# EAGLE schematic TERMINAL_SHIELD_ESP32 (EAGLE 9.2.2)
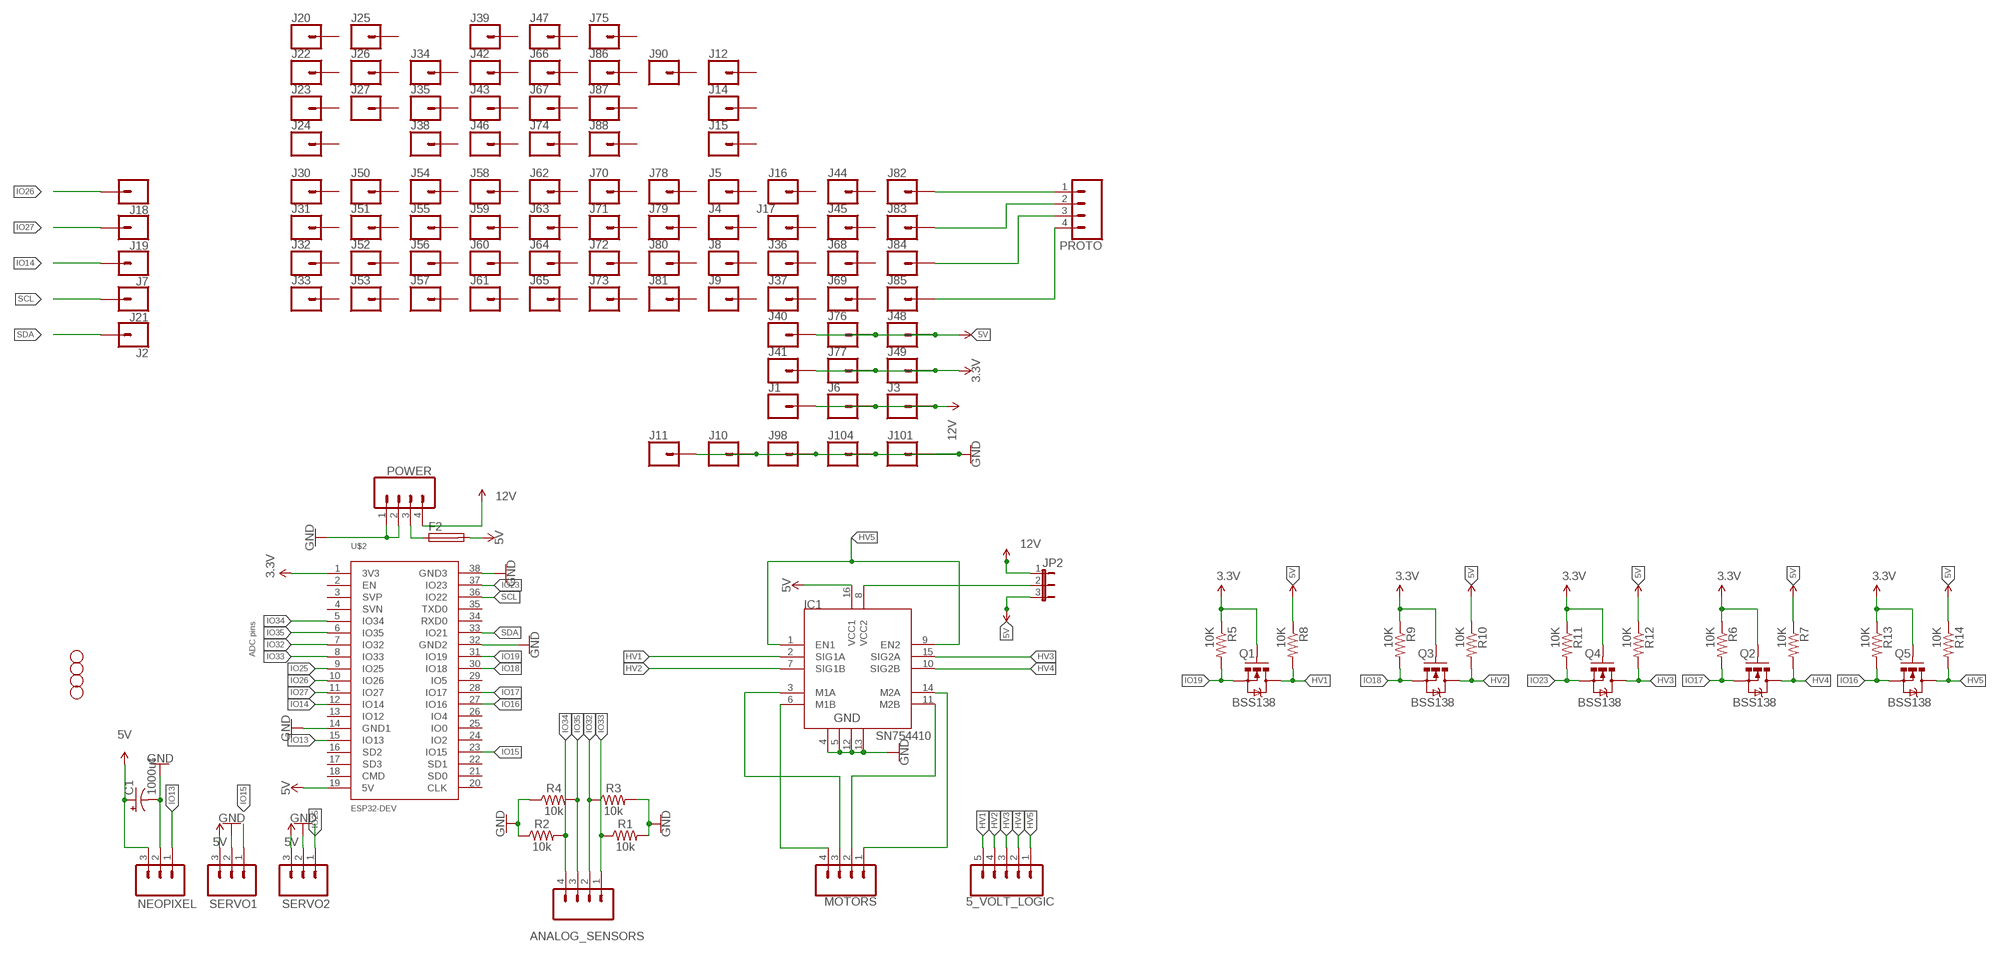
[diagram p0: schematic, sheet 1]

## Parts
5_VOLT_LOGIC  CONN_05SCREW  [SCREWTERMINAL-3.5MM-5]
ANALOG_SENSORS  CONN_04SCREW  [SCREWTERMINAL-3.5MM-4]
C1  1000uf  1000UF-RADIAL-5MM-25V-20%  [CPOL-RADIAL-5MM-10MM]
F2  KS17  [KS17]
H1  STAND-OFF  [STAND-OFF]
H2  STAND-OFF  [STAND-OFF]
H3  STAND-OFF  [STAND-OFF]
H4  STAND-OFF  [STAND-OFF]
IC1  SN754410  [DIP16]
J1  CONN_01  [1X01]
J2  CONN_01  [1X01]
J3  CONN_01  [1X01]
J4  CONN_01  [1X01]
J5  CONN_01  [1X01]
J6  CONN_01  [1X01]
J7  CONN_01  [1X01]
J8  CONN_01  [1X01]
J9  CONN_01  [1X01]
J10  CONN_01  [1X01]
J11  CONN_01  [1X01]
J12  CONN_01  [1X01]
J14  CONN_01  [1X01]
J15  CONN_01  [1X01]
J16  CONN_01  [1X01]
J17  CONN_01  [1X01]
J18  CONN_01  [1X01]
J19  CONN_01  [1X01]
J20  CONN_01  [1X01]
J21  CONN_01  [1X01]
J22  CONN_01  [1X01]
J23  CONN_01  [1X01]
J24  CONN_01  [1X01]
J25  CONN_01  [1X01]
J26  CONN_01  [1X01]
J27  CONN_01  [1X01]
J30  CONN_01  [1X01]
J31  CONN_01  [1X01]
J32  CONN_01  [1X01]
J33  CONN_01  [1X01]
J34  CONN_01  [1X01]
J35  CONN_01  [1X01]
J36  CONN_01  [1X01]
J37  CONN_01  [1X01]
J38  CONN_01  [1X01]
J39  CONN_01  [1X01]
J40  CONN_01  [1X01]
J41  CONN_01  [1X01]
J42  CONN_01  [1X01]
J43  CONN_01  [1X01]
J44  CONN_01  [1X01]
J45  CONN_01  [1X01]
J46  CONN_01  [1X01]
J47  CONN_01  [1X01]
J48  CONN_01  [1X01]
J49  CONN_01  [1X01]
J50  CONN_01  [1X01]
J51  CONN_01  [1X01]
J52  CONN_01  [1X01]
J53  CONN_01  [1X01]
J54  CONN_01  [1X01]
J55  CONN_01  [1X01]
J56  CONN_01  [1X01]
J57  CONN_01  [1X01]
J58  CONN_01  [1X01]
J59  CONN_01  [1X01]
J60  CONN_01  [1X01]
J61  CONN_01  [1X01]
J62  CONN_01  [1X01]
J63  CONN_01  [1X01]
J64  CONN_01  [1X01]
J65  CONN_01  [1X01]
J66  CONN_01  [1X01]
J67  CONN_01  [1X01]
J68  CONN_01  [1X01]
J69  CONN_01  [1X01]
J70  CONN_01  [1X01]
J71  CONN_01  [1X01]
J72  CONN_01  [1X01]
J73  CONN_01  [1X01]
J74  CONN_01  [1X01]
J75  CONN_01  [1X01]
J76  CONN_01  [1X01]
J77  CONN_01  [1X01]
J78  CONN_01  [1X01]
J79  CONN_01  [1X01]
J80  CONN_01  [1X01]
J81  CONN_01  [1X01]
J82  CONN_01  [1X01]
J83  CONN_01  [1X01]
J84  CONN_01  [1X01]
J85  CONN_01  [1X01]
J86  CONN_01  [1X01]
J87  CONN_01  [1X01]
J88  CONN_01  [1X01]
J90  CONN_01  [1X01]
J98  CONN_01  [1X01]
J101  CONN_01  [1X01]
J104  CONN_01  [1X01]
JP2  JP2E  [JP2]
MOTORS  CONN_04SCREW  [SCREWTERMINAL-3.5MM-4]
NEOPIXEL  CONN_03SCREW  [SCREWTERMINAL-3.5MM-3]
POWER  CONN_04SCREW  [SCREWTERMINAL-3.5MM-4]
PROTO  CONN_04SCREW  [SCREWTERMINAL-3.5MM-4]
Q1  BSS138  MOSFET-NCHANNELSMD  [SOT23-3]
Q2  BSS138  MOSFET-NCHANNELSMD  [SOT23-3]
Q3  BSS138  MOSFET-NCHANNELSMD  [SOT23-3]
Q4  BSS138  MOSFET-NCHANNELSMD  [SOT23-3]
Q5  BSS138  MOSFET-NCHANNELSMD  [SOT23-3]
R1  10k  10KOHM-HORIZ-1/4W-1%  [AXIAL-0.3]
R2  10k  10KOHM-HORIZ-1/4W-1%  [AXIAL-0.3]
R3  10k  10KOHM-HORIZ-1/4W-1%  [AXIAL-0.3]
R4  10k  10KOHM-HORIZ-1/4W-1%  [AXIAL-0.3]
R5  10K  RESISTOR0805-RES  [0805]
R6  10K  RESISTOR0805-RES  [0805]
R7  10K  RESISTOR0805-RES  [0805]
R8  10K  RESISTOR0805-RES  [0805]
R9  10K  RESISTOR0805-RES  [0805]
R10  10K  RESISTOR0805-RES  [0805]
R11  10K  RESISTOR0805-RES  [0805]
R12  10K  RESISTOR0805-RES  [0805]
R13  10K  RESISTOR0805-RES  [0805]
R14  10K  RESISTOR0805-RES  [0805]
SERVO1  CONN_03SCREW  [SCREWTERMINAL-3.5MM-3]
SERVO2  CONN_03SCREW  [SCREWTERMINAL-3.5MM-3]
U$2  ESP32-DEV  [ESP32-DEV]

## Nets
3.3V [powerLow]: J41.1 J49.1 J77.1 Q1.1(G) Q2.1(G) Q3.1(G) Q4.1(G) Q5.1(G) R5.1 R6.1 R9.1 R11.1 R13.1 U$2.1(3V3)
5V: C1.+ F2.2 IC1.16(VCC1) J40.1 J48.1 J76.1 JP2.3 NEOPIXEL.3 R7.1 R8.1 R10.1 R12.1 R14.1 SERVO1.3 SERVO2.3 U$2.19(5V) ; supply symbol labelled HV
12V: J1.1 J3.1 J6.1 JP2.1 POWER.4
GND: C1.- IC1.4 IC1.5 IC1.12 IC1.13 J10.1 J11.1 J98.1 J101.1 J104.1 NEOPIXEL.2 POWER.1 POWER.2 R1.P$2 R2.P$1 R3.P$2 R4.P$1 SERVO1.2 SERVO2.2 U$2.14(GND1) U$2.32(GND2) U$2.38(GND3)
HV1: 5_VOLT_LOGIC.5 IC1.2(SIG1A) Q1.3(D) R8.2
HV2: 5_VOLT_LOGIC.4 IC1.7(SIG1B) Q3.3(D) R10.2
HV3: 5_VOLT_LOGIC.3 IC1.15(SIG2A) Q4.3(D) R12.2
HV4: 5_VOLT_LOGIC.2 IC1.10(SIG2B) Q2.3(D) R7.2
HV5: 5_VOLT_LOGIC.1 IC1.1(EN1) IC1.9(EN2) Q5.3(D) R14.2
IO13: NEOPIXEL.1 U$2.15(IO13)
IO14: J7.1 U$2.12(IO14)
IO15: SERVO1.1 U$2.23(IO15)
IO16: Q5.2(S) R13.2 U$2.27(IO16)
IO17: Q2.2(S) R6.2 U$2.28(IO17)
IO18: Q3.2(S) R9.2 U$2.30(IO18)
IO19: Q1.2(S) R5.2 U$2.31(IO19)
IO23: Q4.2(S) R11.2 U$2.37(IO23)
IO25: SERVO2.1 U$2.9(IO25)
IO26: J18.1 U$2.10(IO26)
IO27: J19.1 U$2.11(IO27)
IO32: ANALOG_SENSORS.2 R3.P$1 U$2.7(IO32)
IO33: ANALOG_SENSORS.1 R1.P$1 U$2.8(IO33)
IO34: ANALOG_SENSORS.4 R2.P$2 U$2.5(IO34)
IO35: ANALOG_SENSORS.3 R4.P$2 U$2.6(IO35)
M1A [MOTOR]: IC1.6(M1B) MOTORS.4
M1B [MOTOR]: IC1.3(M1A) MOTORS.3
M2A [MOTOR]: IC1.14(M2A) MOTORS.1
M2B [MOTOR]: IC1.11(M2B) MOTORS.2
N$5: IC1.8(VCC2) JP2.2
N$16: J82.1 PROTO.1
N$17: J83.1 PROTO.2
N$18: J84.1 PROTO.3
N$19: J85.1 PROTO.4
N$26: F2.1 POWER.3
SCL: J21.1 U$2.36(IO22)
SDA: J2.1 U$2.33(IO21)
Unconnected: J4.1 J5.1 J8.1 J9.1 J12.1 J14.1 J15.1 J16.1 J17.1 J20.1 J22.1 J23.1 J24.1 J25.1 J26.1 J27.1 J30.1 J31.1 J32.1 J33.1 J34.1 J35.1 J36.1 J37.1 J38.1 J39.1 J42.1 J43.1 J44.1 J45.1 J46.1 J47.1 J50.1 J51.1 J52.1 J53.1 J54.1 J55.1 J56.1 J57.1 J58.1 J59.1 J60.1 J61.1 J62.1 J63.1 J64.1 J65.1 J66.1 J67.1 J68.1 J69.1 J70.1 J71.1 J72.1 J73.1 J74.1 J75.1 J78.1 J79.1 J80.1 J81.1 J86.1 J87.1 J88.1 J90.1 U$2.2(EN) U$2.3(SVP) U$2.4(SVN) U$2.13(IO12) U$2.16(SD2) U$2.17(SD3) U$2.18(CMD) U$2.20(CLK) U$2.21(SD0) U$2.22(SD1) U$2.24(IO2) U$2.25(IO0) U$2.26(IO4) U$2.29(IO5) U$2.34(RXD0) U$2.35(TXD0)

## Notes on the sheet
- ADC pins

## Library data of the parts
5_VOLT_LOGIC = SparkFun-Connectors:CONN_05: Multi connection point. Often used as Generic Header-pin footprint for 0.1 inch spaced/style header connections On any of the 0.1 inch spaced packages, you can populate with these: Break Away Headers - Straight <https://www.sparkfun.com/products/116> (PRT-00116) Break Away Male Headers - Right Angle <https://www.sparkfun.com/products/553> (PRT-00553) Female Headers <https://www.sparkfun.com/products/115> (PRT-00115) Break Away Headers - Machine Pin <https://www.sparkfun.com/products/117> (PRT-00117) Break Away Female Headers - Swiss Machine Pin <https://www.sparkfun.com/products/743> (PRT-00743) For SCREWTERMINALS and SPRING TERMINALS visit here: Screw Terimnals on SparkFun.com <https://www.sparkfun.com/search/results?term=Screw+Terminals> (5mm/3.5mm/2.54mm spacing) This device is also useful as a general connection point to wire up your design to another part of your project. Our various solder wires solder well into these plated through hole pads. Hook-Up Wire - Assortment (Stranded, 22 AWG) <https://www.sparkfun.com/products/11375> (PRT-11375) Hook-Up Wire - Assortment (Solid Core, 22 AWG) <https://www.sparkfun.com/products/11367> (PRT-11367) View the entire wire category on our website here <https://www.sparkfun.com/categories/141> Special notes: Molex polarized connector foot print use with SKU : PRT-08231 with associated crimp pins and housings. 1MM SMD Version SKU: PRT-10208; PROD_ID: Combine 8288+8399
ANALOG_SENSORS MOTORS POWER PROTO = SparkFun-Connectors:CONN_04: Multi connection point. Often used as Generic Header-pin footprint for 0.1 inch spaced/style header connections On any of the 0.1 inch spaced packages, you can populate with these: Break Away Headers - Straight <https://www.sparkfun.com/products/116> (PRT-00116) Break Away Male Headers - Right Angle <https://www.sparkfun.com/products/553> (PRT-00553) Female Headers <https://www.sparkfun.com/products/115> (PRT-00115) Break Away Headers - Machine Pin <https://www.sparkfun.com/products/117> (PRT-00117) Break Away Female Headers - Swiss Machine Pin <https://www.sparkfun.com/products/743> (PRT-00743) For SCREWTERMINALS and SPRING TERMINALS visit here: Screw Terimnals on SparkFun.com <https://www.sparkfun.com/search/results?term=Screw+Terminals> (5mm/3.5mm/2.54mm spacing) This device is also useful as a general connection point to wire up your design to another part of your project. Our various solder wires solder well into these plated through hole pads. Hook-Up Wire - Assortment (Stranded, 22 AWG) <https://www.sparkfun.com/products/11375> (PRT-11375) Hook-Up Wire - Assortment (Solid Core, 22 AWG) <https://www.sparkfun.com/products/11367> (PRT-11367) View the entire wire category on our website here <https://www.sparkfun.com/categories/141> Special notes: Molex polarized connector foot print use with SKU : PRT-08231 with associated crimp pins and housings. 1MM SMD Version SKU: PRT-10208; PROD_ID: 2xCONN-08399; SF_ID: 2xPRT-08084
C1 = SparkFun-Capacitors:1000UF: 1,000µF/1mF ceramic capacitors A capacitor is a passive two-terminal electrical component used to store electrical energy temporarily in an electric field. CAP-08070; PROD_ID: CAP-09538; VALUE: 1mF
F2 = fuse:KS17: FUSE HOLDER CS, Schukat; OC_FARNELL: unknown; OC_NEWARK: unknown
H1-H4 = SparkFun-Hardware:STAND-OFF: Stand Off Drill holes for mechanically mounting via screws, standoffs, etc. Note: Use the keepout ring to avoid running the screw head into surrounding components. Variant Overviews STAND-OFF - Mechanical footprint for a #4 phillips button head screw. STAND-OFF-TIGHT - Mechanical footprint for a #4 phillips button head screw, Example SparkFun Products Screw - Phillips Head (1/4", 4-40, 10 pack) <https://www.sparkfun.com/products/10453> (PRT-10453) Screw - Phillips Head (1/2", 4-40, 10 pack) <https://www.sparkfun.com/products/10452> (PRT-10452) Screw - Phillips Head (3/4", 4-40, 10 pack) <https://www.sparkfun.com/products/10451> (PRT-10451) Screw - Phillips Head (1", 4-40, 10 pack) <https://www.sparkfun.com/products/10450> (PRT-10450)
IC1 = SN754410:SN754410: Quadruple half-H driver; AVAILABILITY: Unavailable; DESCRIPTION: the sn754410 is a quadruple high-current half-h driver designed to provide bidirectional drive currents up to 1 a at ...; MF: Texas Instruments; MP: SN754410; PACKAGE: None; PRICE: None
J1-J12 J14-J27 J30-J88 J90 J98 J101 J104 = SparkFun-Connectors:CONN_01: Single connection point. Often used as Generic Header-pin footprint for 0.1 inch spaced/style header connections On any of the 0.1 inch spaced packages, you can populate with these: Break Away Headers - Straight <https://www.sparkfun.com/products/116> (PRT-00116) Break Away Male Headers - Right Angle <https://www.sparkfun.com/products/553> (PRT-00553) Female Headers <https://www.sparkfun.com/products/115> (PRT-00115) Break Away Headers - Machine Pin <https://www.sparkfun.com/products/117> (PRT-00117) Break Away Female Headers - Swiss Machine Pin <https://www.sparkfun.com/products/743> (PRT-00743) This device is also useful as a general connection point to wire up your design to another part of your project. Our various solder wires solder well into these plated through hole pads. Hook-Up Wire - Assortment (Stranded, 22 AWG) <https://www.sparkfun.com/products/11375> (PRT-11375) Hook-Up Wire - Assortment (Solid Core, 22 AWG) <https://www.sparkfun.com/products/11367> (PRT-11367) View the entire wire category on our website here <https://www.sparkfun.com/categories/141> Special notes: SMTSO-256-ET is a "flush mount" nut for a 4-40 screw. We mostly use this on specialty testbeds; it is a nice way to connect hardware to your PCB at an adjustable hieght. Also note, the SNAP packages are for using a snappable style connector. We sell a baggie of snaps and they are also used on two LilyPad designs: Snap Assortment - 30 pack (male and female) <https://www.sparkfun.com/products/11347> (DEV-11347) LilyPad Arduino SimpleSnap <https://www.sparkfun.com/products/10941> (DEV-10941) LilyPad SimpleSnap Protoboard <https://www.sparkfun.com/products/10940> (DEV-10940)
JP2 = jumper:JP2E: JUMPER
NEOPIXEL SERVO1 SERVO2 = SparkFun-Connectors:CONN_03: Multi connection point. Often used as Generic Header-pin footprint for 0.1 inch spaced/style header connections On any of the 0.1 inch spaced packages, you can populate with these: Break Away Headers - Straight <https://www.sparkfun.com/products/116> (PRT-00116) Break Away Male Headers - Right Angle <https://www.sparkfun.com/products/553> (PRT-00553) Female Headers <https://www.sparkfun.com/products/115> (PRT-00115) Break Away Headers - Machine Pin <https://www.sparkfun.com/products/117> (PRT-00117) Break Away Female Headers - Swiss Machine Pin <https://www.sparkfun.com/products/743> (PRT-00743) Stackable Header - 3 Pin (Female, 0.1") <https://www.sparkfun.com/products/13875> (PRT-13875) For SCREWTERMINALS and SPRING TERMINALS visit here: Screw Terimnals on SparkFun.com <https://www.sparkfun.com/search/results?term=Screw+Terminals> (5mm/3.5mm/2.54mm spacing) This device is also useful as a general connection point to wire up your design to another part of your project. Our various solder wires solder well into these plated through hole pads. Hook-Up Wire - Assortment (Stranded, 22 AWG) <https://www.sparkfun.com/products/11375> (PRT-11375) Hook-Up Wire - Assortment (Solid Core, 22 AWG) <https://www.sparkfun.com/products/11367> (PRT-11367) View the entire wire category on our website here <https://www.sparkfun.com/categories/141> Special notes: Molex polarized connector foot print use with SKU : PRT-08232 with associated crimp pins and housings.; PROD_ID: CONN-08288; SF_ID: PRT-08235
Q1-Q5 = SparkFun:MOSFET-NCHANNEL
R1-R4 = SparkFun-Resistors:10KOHM: 10kΩ resistor A resistor is a passive two-terminal electrical component that implements electrical resistance as a circuit element. Resistors act to reduce current flow, and, at the same time, act to lower voltage levels within circuits. - Wikipedia; PROD_ID: RES-12183
R5-R14 = SparkFun:RESISTOR: Resistor Basic schematic elements and footprints for 0603, 1206, and PTH resistors.
U$2 = IAD-Library:ESP32-DEV: Adafruit ESP32 Development Board.

## Net classes
0 default: width 0.381 mm
1 MOTOR: width 0.762 mm
2 powerLow: width 0.508 mm